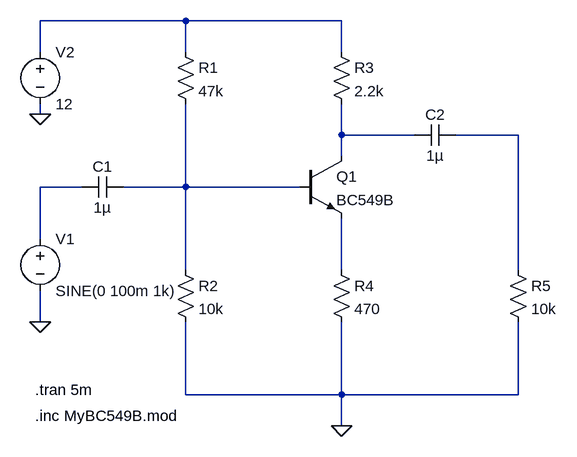
[diagram p0: schematic Common_Emitter_Amplifier.asc]
Common_Emitter_Amplifier.asc, the LTspice schematic file:
Version 4.1
SHEET 1 1192 680
WIRE 448 -208 224 -208
WIRE 688 -208 448 -208
WIRE 224 -160 224 -208
WIRE 448 -160 448 -208
WIRE 688 -160 688 -208
WIRE 224 -64 224 -80
WIRE 688 -32 688 -80
WIRE 800 -32 688 -32
WIRE 960 -32 864 -32
WIRE 688 0 688 -32
WIRE 288 48 224 48
WIRE 448 48 448 -80
WIRE 448 48 352 48
WIRE 624 48 448 48
WIRE 224 128 224 48
WIRE 448 176 448 48
WIRE 688 176 688 96
WIRE 960 176 960 -32
WIRE 224 256 224 208
WIRE 448 368 448 256
WIRE 688 368 688 256
WIRE 688 368 448 368
WIRE 960 368 960 256
WIRE 960 368 688 368
WIRE 688 416 688 368
FLAG 224 -64 0
FLAG 224 256 0
FLAG 688 416 0
SYMBOL voltage 224 112 R0
WINDOW 123 0 0 Left 0
WINDOW 39 0 0 Left 0
SYMATTR InstName V1
SYMATTR Value SINE(0 100m 1k)
SYMBOL voltage 224 -176 R0
WINDOW 123 0 0 Left 0
WINDOW 39 0 0 Left 0
SYMATTR InstName V2
SYMATTR Value 12
SYMBOL cap 352 32 R90
WINDOW 0 0 32 VBottom 2
WINDOW 3 32 32 VTop 2
SYMATTR InstName C1
SYMATTR Value 1µ
SYMBOL cap 864 -48 R90
WINDOW 0 0 32 VBottom 2
WINDOW 3 32 32 VTop 2
SYMATTR InstName C2
SYMATTR Value 1µ
SYMBOL res 432 -176 R0
SYMATTR InstName R1
SYMATTR Value 47k
SYMBOL res 432 160 R0
SYMATTR InstName R2
SYMATTR Value 10k
SYMBOL res 672 -176 R0
SYMATTR InstName R3
SYMATTR Value 2.2k
SYMBOL res 672 160 R0
SYMATTR InstName R4
SYMATTR Value 470
SYMBOL res 944 160 R0
SYMATTR InstName R5
SYMATTR Value 10k
SYMBOL npn 624 0 R0
SYMATTR InstName Q1
SYMATTR Value BC549B
TEXT 216 360 Left 2 !.tran 5m
TEXT 216 400 Left 2 !.inc MyBC549B.mod

The netlist it stands for:
* Common_Emitter_Amplifier.asc
V1 N004 0 SINE(0 100m 1k)
V2 N001 0 12
C1 N005 N004 1µ
C2 N003 N002 1µ
R1 N001 N005 47k
R2 N005 0 10k
R3 N001 N002 2.2k
R4 N006 0 470
R5 N003 0 10k
Q1 N002 N005 N006 0 BC549B
.model NPN NPN
.model PNP PNP
.lib standard.bjt
.tran 5m
.inc MyBC549B.mod
.backanno
.end